# Altium schematic sheet Sensors.SchDoc
size A4
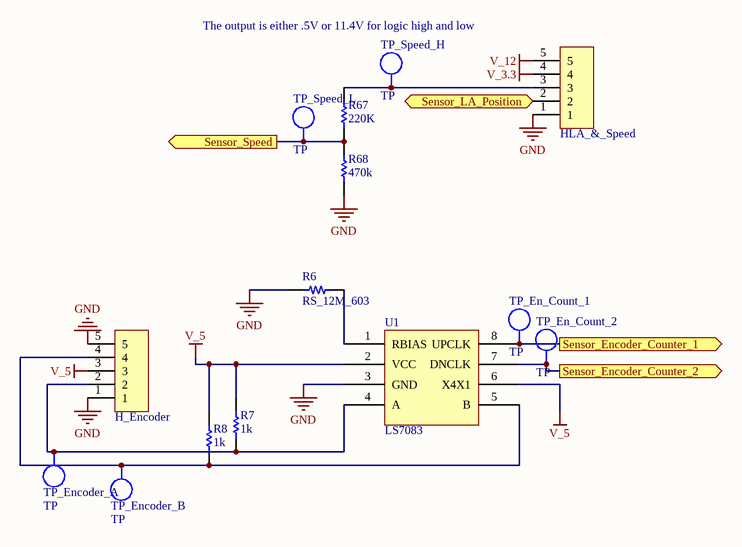
[diagram p0: Sensors.SchDoc]

## Parts
H_Encoder  53261-0571  [53261-0571]  (value not drawn)
HLA_&_Speed  53261-0571  [53261-0571]  (value not drawn)
R6  RS_12M_603  [0603 Resistor]
R7  1k  [0603]
R8  1k  [0603]
R67  220K  [0603]
R68  470k  [0603]
TP_En_Count_1  TP  [TEST_POINT_4X2MM]  (no BOM)
TP_En_Count_2  TP  [TEST_POINT_4X2MM]  (no BOM)
TP_Encoder_A  TP  [TEST_POINT_4X2MM]  (no BOM)
TP_Encoder_B  TP  [TEST_POINT_4X2MM]  (no BOM)
TP_Speed_H  TP  [TEST_POINT_4X2MM]  (no BOM)
TP_Speed_L  TP  [TEST_POINT_4X2MM]  (no BOM)
U1  LS7083

## Ports
Sensor_Encoder_Counter_1 (out), Sensor_Encoder_Counter_2 (out), Sensor_LA_Position (out), Sensor_Speed (out)

## Nets
GND: H_Encoder.1 H_Encoder.5 HLA_&_Speed.1 R6.1 R68.1 U1.3(GND)
V_3.3: HLA_&_Speed.4
V_5: H_Encoder.3 R7.2 R8.2 U1.2(VCC) U1.6(X4X1)
V_12: HLA_&_Speed.5
Sensor_Encoder_Counter_1: TP_En_Count_1.1 U1.8(UPCLK) ; port Sensor_Encoder_Counter_1
Sensor_Encoder_Counter_2: TP_En_Count_2.1 U1.7(DNCLK) ; port Sensor_Encoder_Counter_2
Sensor_LA_Position: HLA_&_Speed.2 ; port Sensor_LA_Position
Sensor_Speed: R67.1 R68.2 TP_Speed_L.1 ; port Sensor_Speed
NetH_Encoder_2: H_Encoder.2 R7.1 TP_Encoder_A.1 U1.4(A)
NetH_Encoder_4: H_Encoder.4 R8.1 TP_Encoder_B.1 U1.5(B)
NetHLA_&_Speed_3: HLA_&_Speed.3 R67.2 TP_Speed_H.1
NetR6_2: R6.2 U1.1(RBIAS)

## Notes on the sheet
- The output is either .5V or 11.4V for logic high and low

## Library data of the parts
H_Encoder HLA_&_Speed = 53261-0571: 5-pin PicoBlade Right-angle Header; Manufacturer: Molex; Supplier: Digikey; Supplier Part Number: WM7623CT-ND; Manufacturer Part Number: 53261-0571
R6 = RS_12M_603: Manufacturer: Panasonic - ECG; Manufacturer Part Number: ERJ-3GEYK126V; Supplier Part Number 1: P12MGCT-ND; Supplier 1: Digi-Key
R7 R8 = RS_1k 0603: RES 1.00K OHM 1/10W 1% 0603 SMD; Manufacturer: ROHM; Manufacturer PN: MCR03EZPFX1001; LatestRevisionDate: 17-Jul-2002; Supplier 1: Digi-Key; Supplier Part Number 1: RHM1.00KHTR-ND; Value: 1k; Part Number: RS_1k 0603; Component Kind: Standard; Component Type: Standard; Designator: RS_1k 0603; Pin Count: 2; Signal Integrity: Res; Simulation: RESISTOR
R67 = RS_220k 0603: RES 3.3K OHM 1/10W 5% 0603 SMD; Manufacturer: Yageo; Manufacturer PN: RC0603JR-073K3L; LatestRevisionDate: 1 Jun 08; Supplier 1: Digi-Key; Supplier Part Number 1: 311-220KGRTR-ND; Value: 220K; Part Number: RS_220k 0603; Component Kind: Standard; Component Type: Standard; Designator: RS_220k 0603; Pin Count: 2; Signal Integrity: Res; Simulation: RESISTOR
R68 = RS_470k 0603: RES 470K OHM 1/10W 5% 0603 SMD; Manufacturer: Yagep; Manufacturer PN: RC0603JR-07470KL; LatestRevisionDate: 25 June 2009; Supplier 1: Digi-Key; Value: 470k; Supplier Part Number 1: 311-470KGRTR-ND; Part Number: RS_470k 0603; Component Kind: Standard; Component Type: Standard; Designator: RS_470k 0603; Pin Count: 2; Signal Integrity: Res; Simulation: RESISTOR
TP_En_Count_1 TP_En_Count_2 TP_Encoder_A TP_Encoder_B TP_Speed_H TP_Speed_L = TP_TESTPOINT: Test-Point; LatestRevisionDate: 29 May 08; Manufacturer PN: *; Manufacturer: *; Supplier 1: Digi-Key; Supplier Part Number 1: 5016KTR-ND; Value: TP; Part Number: TP_TESTPOINT; Component Type: Standard (No BOM); Designator: TP_TESTPOINT; Pin Count: 1
U1 = LS7083: Manufacturer: LSI CSI; Supplier Part Number 1: U423428; Supplier 1: Active Components